# EAGLE design synapseWearV1-4 (EAGLE 9.1.3)
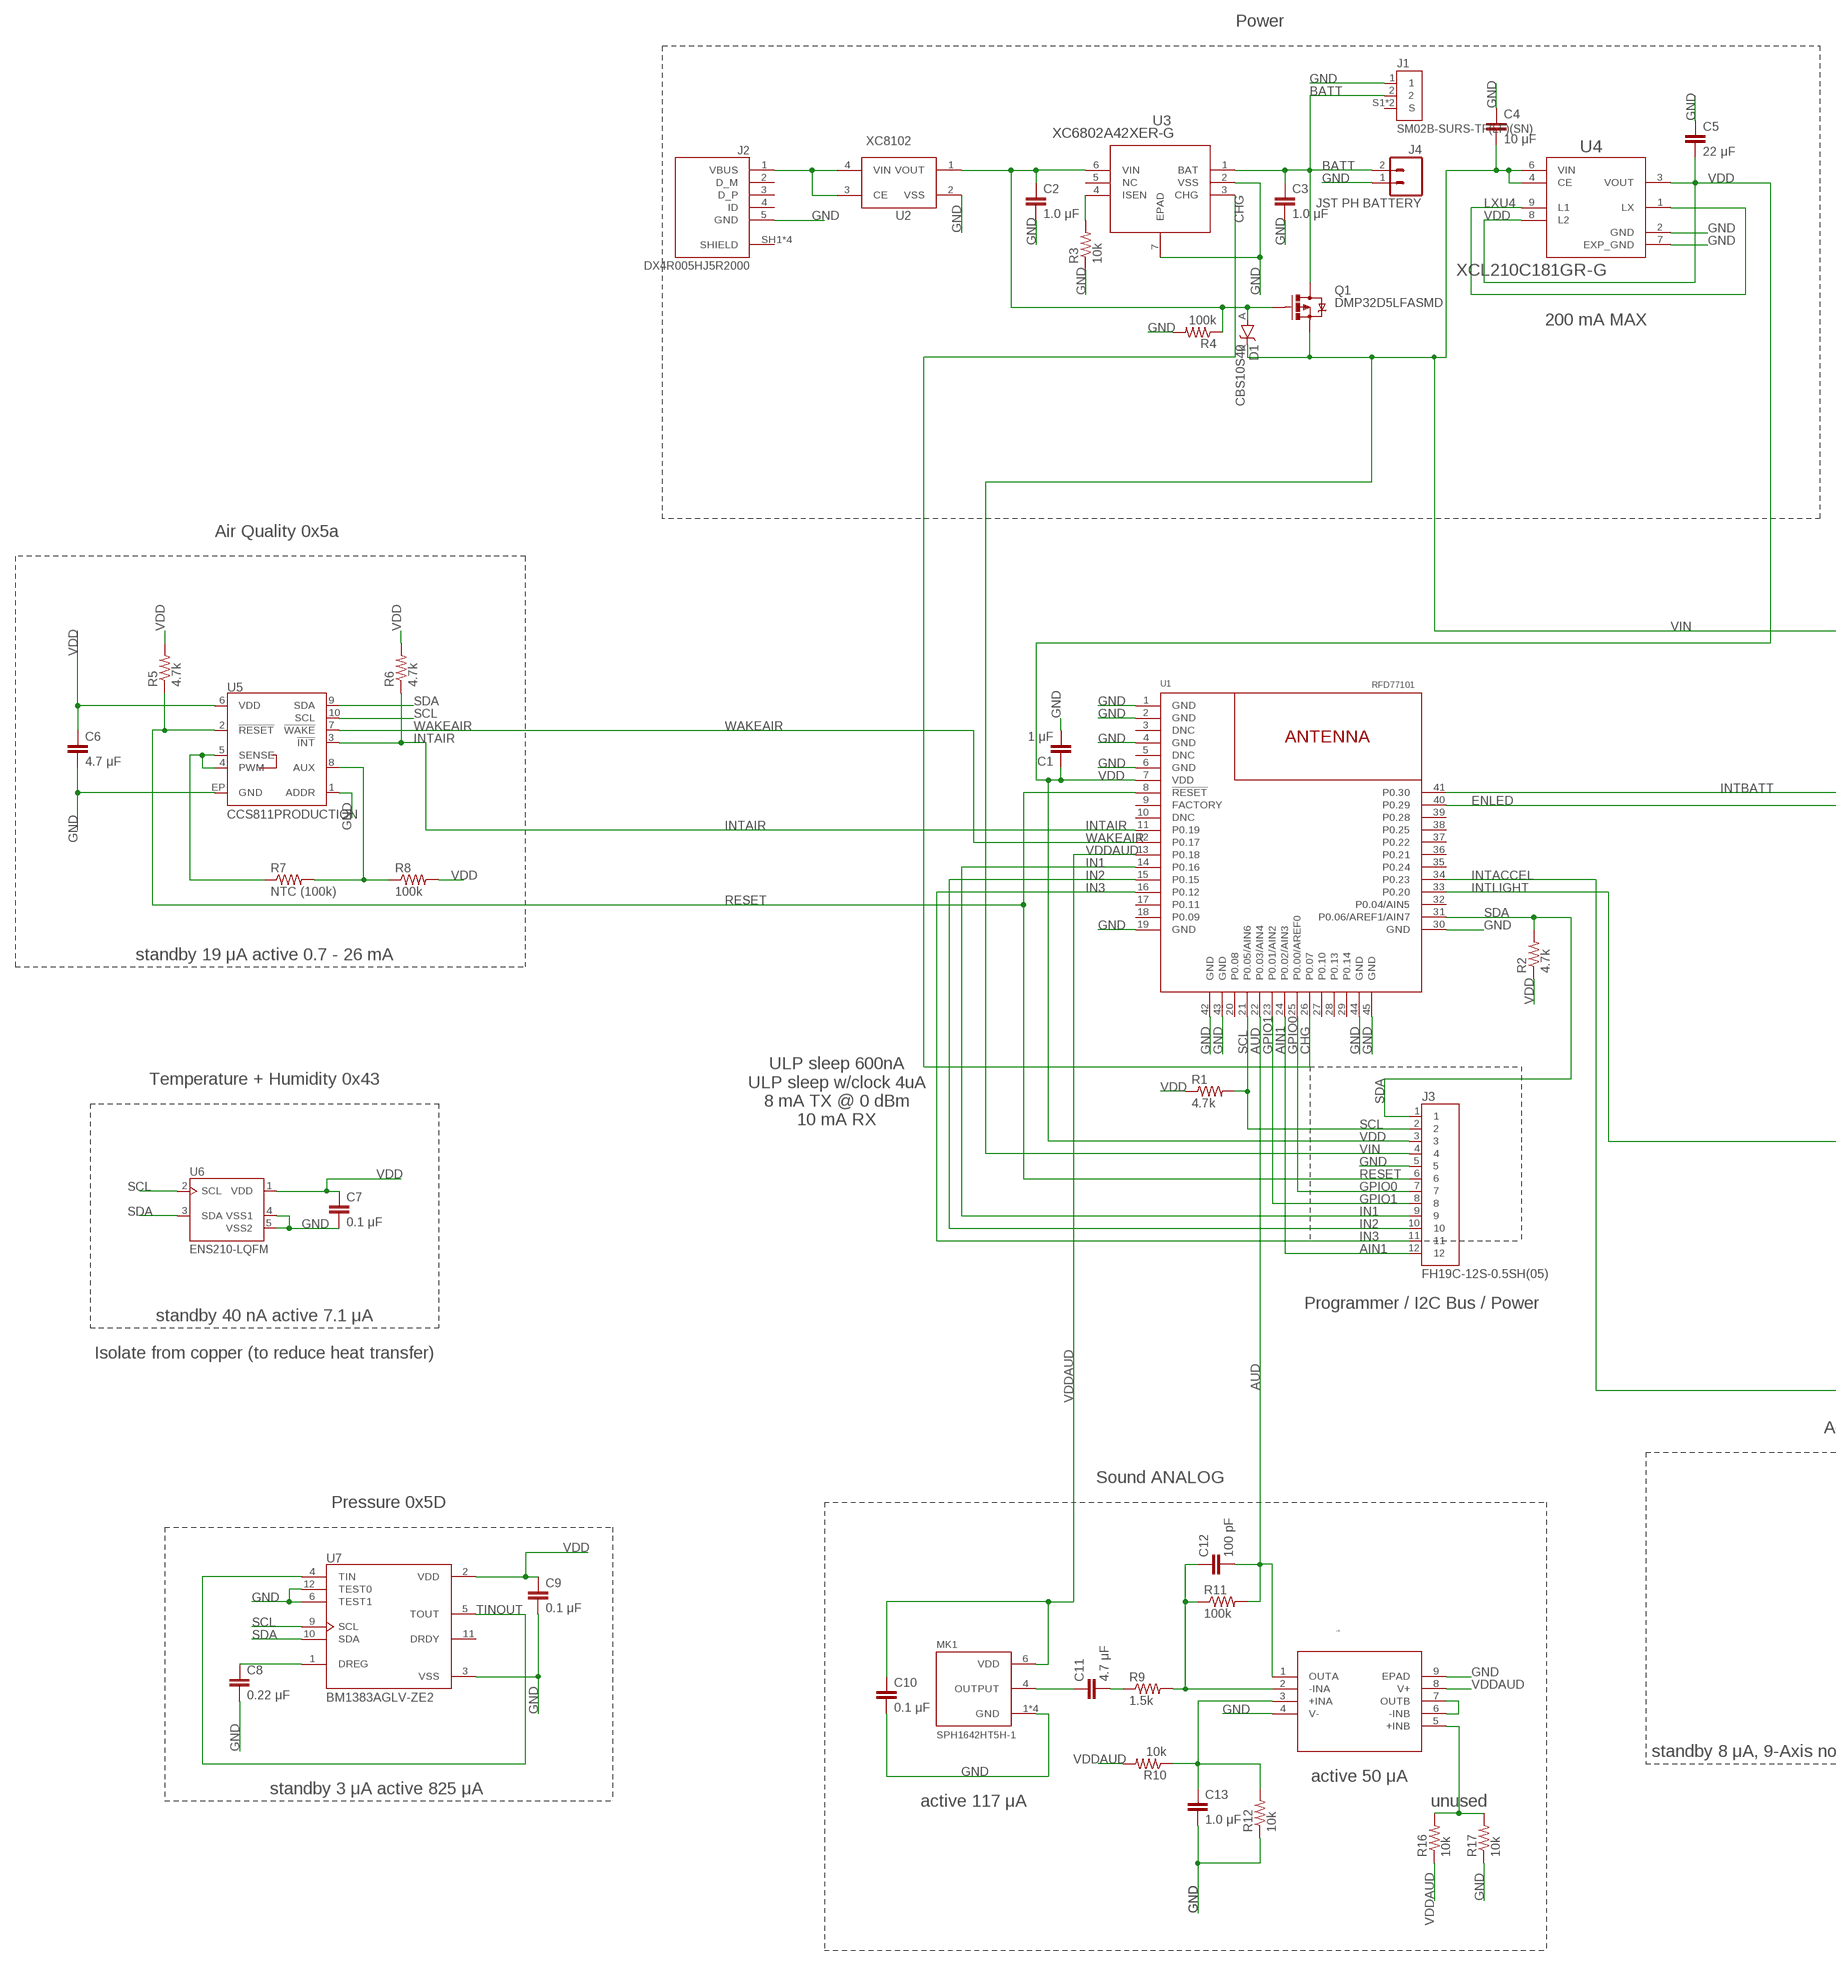
[diagram p0: schematic, sheet 1, part 1 of 2]
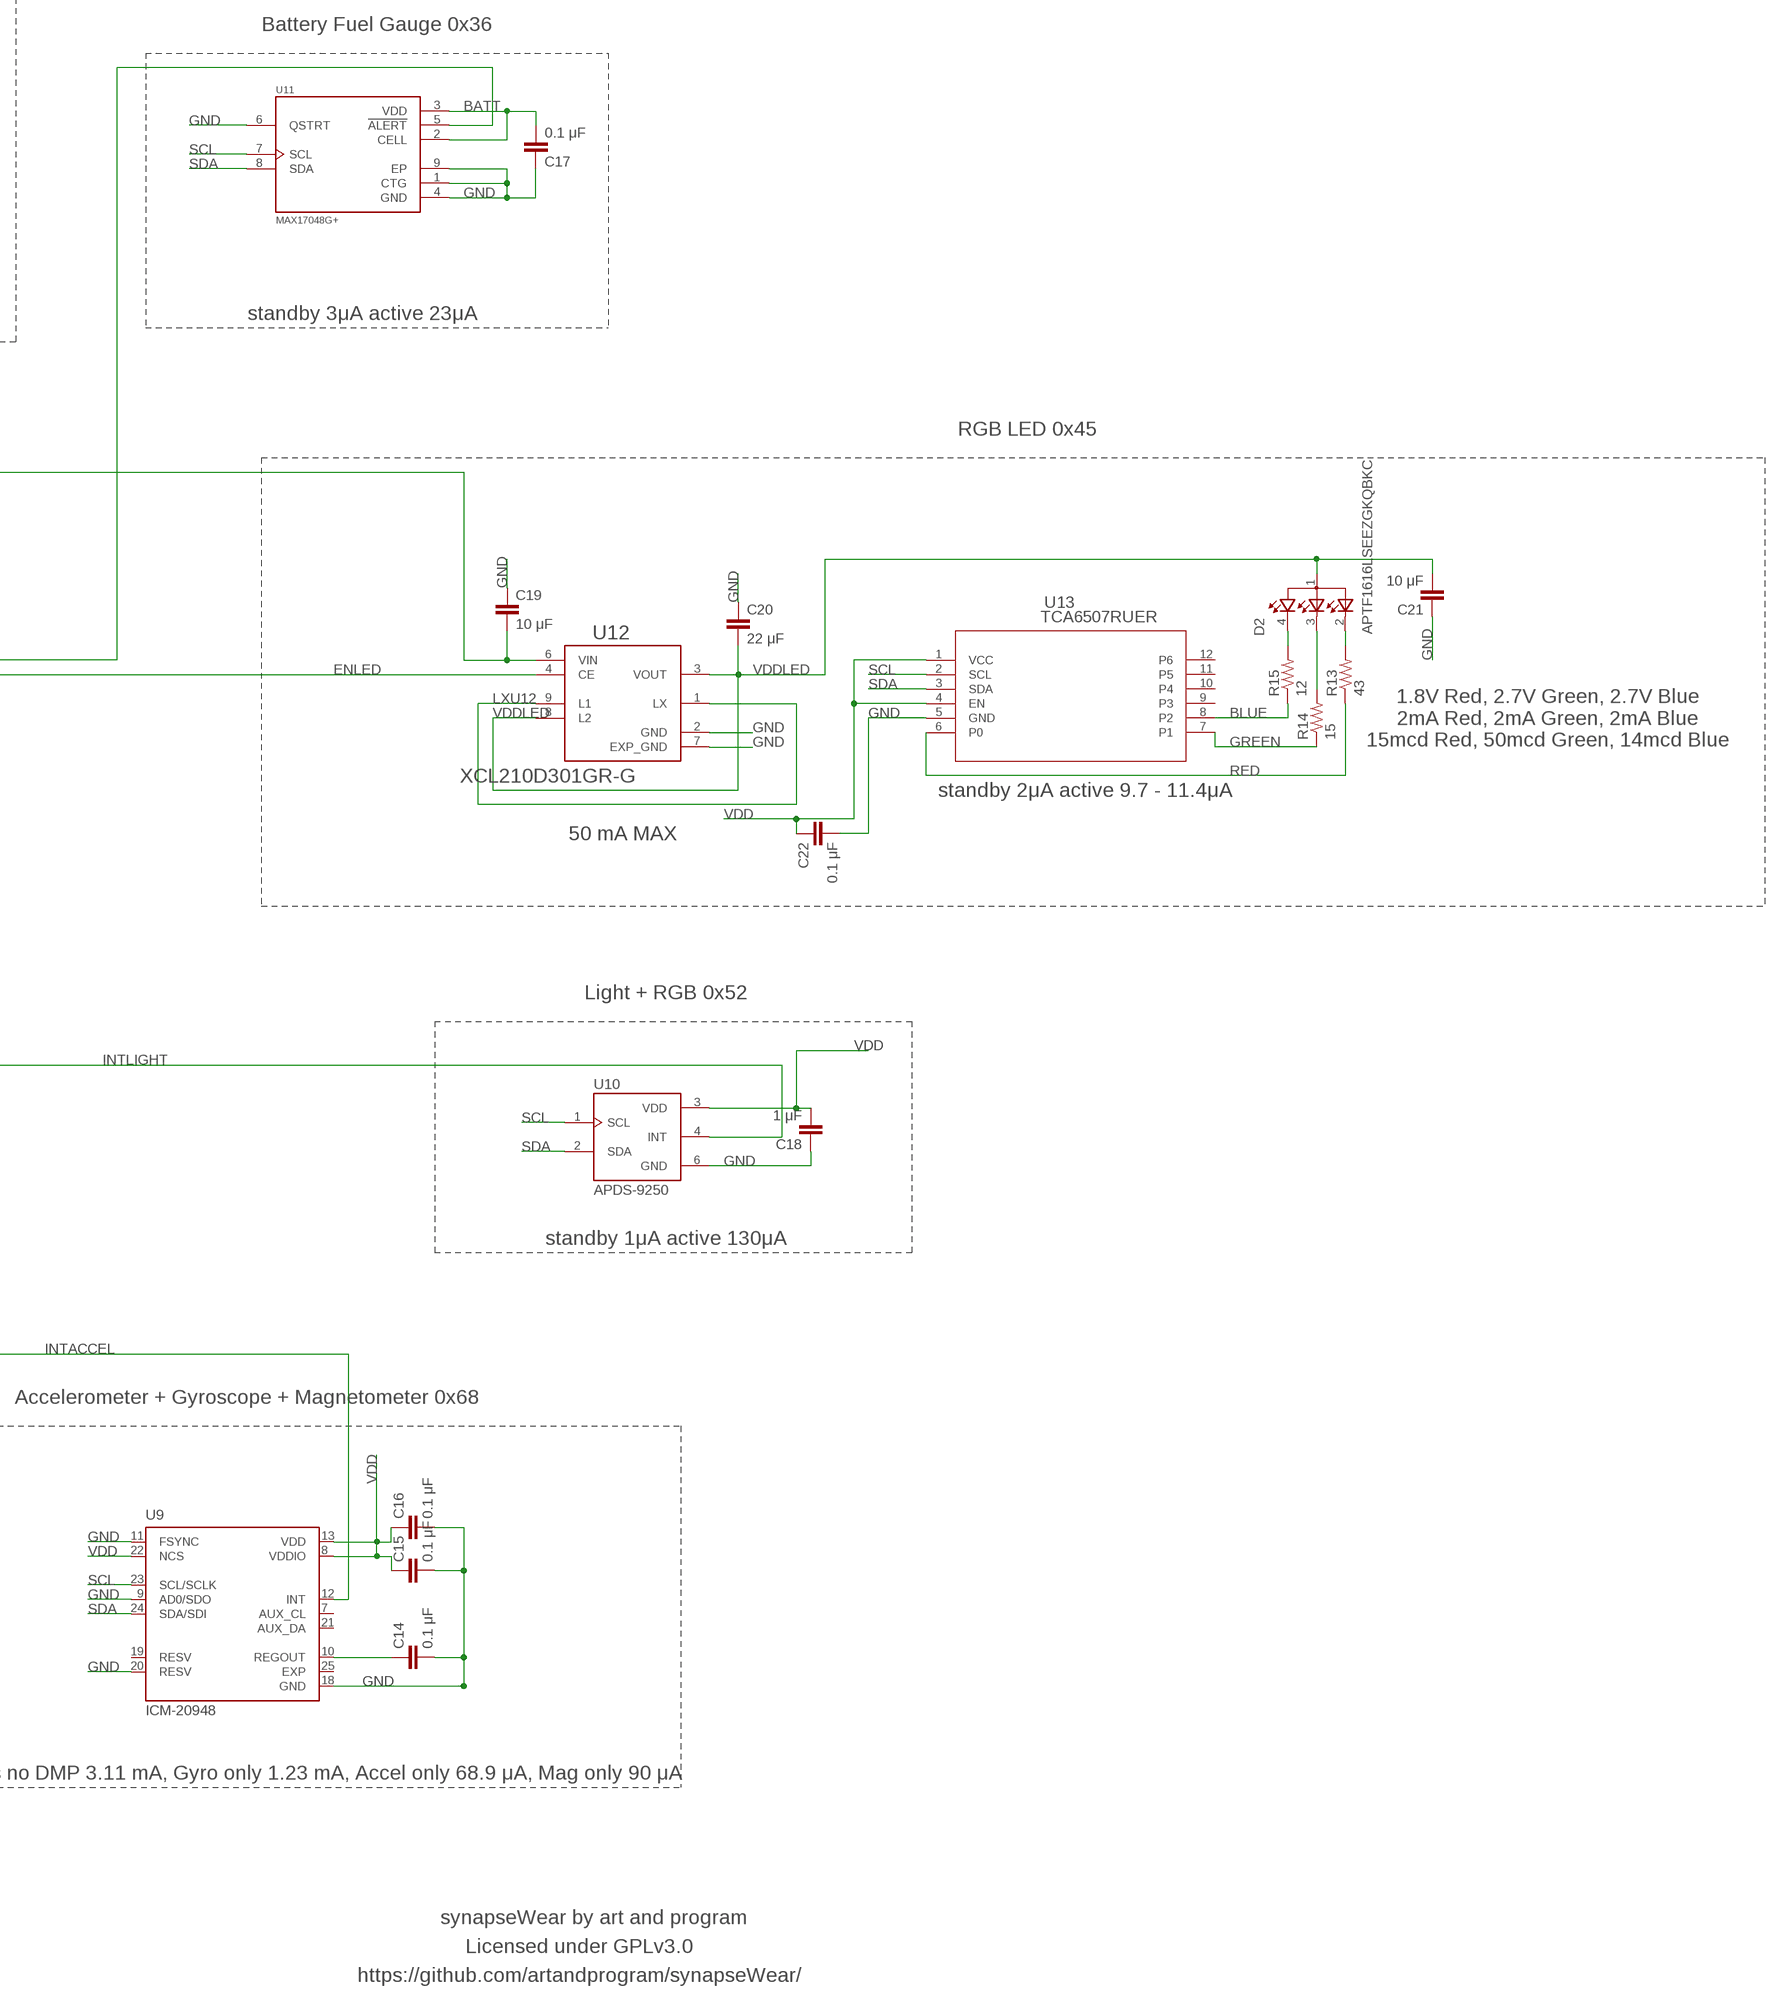
[diagram p1: schematic, sheet 1, part 2 of 2]

## Parts
C1  1 μF  CAP0402-CAP  [0402-CAP]
C2  1.0 μF  CAP0402-CAP  [0402-CAP]
C3  1.0 μF  CAP0402-CAP  [0402-CAP]
C4  10 μF  CAP0402-CAP  [0402-CAP]
C5  22 μF  CAP0402-CAP  [0402-CAP]
C6  4.7 μF  CAP0402-CAP  [0402-CAP]
C7  0.1 μF  CAP0402-CAP  [0402-CAP]
C8  0.22 μF  CAP0402-CAP  [0402-CAP]
C9  0.1 μF  CAP0402-CAP  [0402-CAP]
C10  0.1 μF  CAP0402-CAP  [0402-CAP]
C11  4.7 μF  CAP0402-CAP  [0402-CAP]
C12  100 pF  CAP0402-CAP  [0402-CAP]
C13  1.0 μF  CAP0402-CAP  [0402-CAP]
C14  0.1 μF  CAP0402-CAP  [0402-CAP]
C15  0.1 μF  CAP0402-CAP  [0402-CAP]
C16  0.1 μF  CAP0402-CAP  [0402-CAP]
C17  0.1 μF  CAP0402-CAP  [0402-CAP]
C18  1 μF  CAP0402-CAP  [0402-CAP]
C19  10 μF  CAP0402-CAP  [0402-CAP]
C20  22 μF  CAP0402-CAP  [0402-CAP]
C21  10 μF  CAP0402-CAP  [0402-CAP]
C22  0.1 μF  CAP0402-CAP  [0402-CAP]
D1  CBS10S40  [CST2B]
D2  APTF1616LSEEZGKQBKC  [LEDSC160X160X070-4N]
J1  SM02B-SURS-TF(LF)(SN)  [JST_SM02B-SURS-TF(LF)(SN)]
J2  DX4R005HJ5R2000  [JAE_DX4R005HJ5R2000]
J3  FH19C-12S-0.5SH(05)  [HRS_FH19C-12S-0.5SH(05)]
J4  JST PH BATTERY  M02JST-PTH-VERT  [JST-2-PTH-VERT]
MK1  SPH1642HT5H-1  [MIC_SPH1642HT5H-1]
Q1  DMP32D5LFASMD  [X2-DFN0806-3]
R1  4.7k  RESISTOR0402  [0402-RES]
R2  4.7k  RESISTOR0402  [0402-RES]
R3  10k  RESISTOR0402  [0402-RES]
R4  100k  RESISTOR0402  [0402-RES]
R5  4.7k  RESISTOR0402  [0402-RES]
R6  4.7k  RESISTOR0402  [0402-RES]
R7  NTC (100k)  RESISTOR0402  [0402-RES]
R8  100k  RESISTOR0402  [0402-RES]
R9  1.5k  RESISTOR0402  [0402-RES]
R10  10k  RESISTOR0402  [0402-RES]
R11  100k  RESISTOR0402  [0402-RES]
R12  10k  RESISTOR0402  [0402-RES]
R13  43  RESISTOR0402  [0402-RES]
R14  15  RESISTOR0402  [0402-RES]
R15  12  RESISTOR0402  [0402-RES]
R16  10k  RESISTOR0402  [0402-RES]
R17  10k  RESISTOR0402  [0402-RES]
U1  RFD77101  [RFD77101]
U2  XC8102  XC8102GR-G  [USP-4]
U3  XC6802A42XER-G  [USP-6C]
U4  XCL210C181GR-G  [CL-2025-02]
U5  CCS811PRODUCTION  [LGA10]
U6  ENS210-LQFM  [SON95P200X200X80-5N160X70]
U7  BM1383AGLV-ZE2  [PQFN55P250X250X100-12N]
U8  OPA2313IDRGT  [DRG8_1P2X2P0]
U9  ICM-20948  [QFN40P300X300X105-25N]
U10  APDS-9250  [SON65P200X200X75-6N]
U11  MAX17048G+  [SON50P200X200X80-9N]
U12  XCL210D301GR-G  [CL-2025-02]
U13  TCA6507RUER  [RUE12]

## Nets
+INA: C13.1 R10.1 R12.2 U8.3(+INA)
+INB: R16.2 R17.2 U8.5(+INB)
-INA: C12.1 R9.2 R11.1 U8.2(-INA)
-INB: U8.6(-INB) U8.7(OUTB)
AIN1: J3.12 U1.24(P0.02/AIN3)
AUD: C12.2 R11.2 U1.22(P0.03/AIN4) U8.1(OUTA)
AUX: R7.2 R8.1 U5.8(AUX)
BATT: C3.1 C17.2 J1.2 J4.2 Q1.D U3.1(BAT) U11.2(CELL) U11.3(VDD)
BLUE: R15.1 U13.8(P2)
CHG: U1.26(P0.07) U3.3(CHG)
DREG: C8.1 U7.1(DREG)
ENLED: U1.40(P0.29) U12.4(CE)
GND: C1.2 C2.2 C3.2 C4.1 C5.1 C6.2 C7.2 C8.2 C9.2 C10.2 C13.2 C14.2 C15.2 C16.2 C17.1 C18.1 C19.1 C20.1 C21.1 C22.2 J1.1 J2.5(GND) J3.5 J4.1 MK1.1(GND) MK1.2(GND) MK1.3(GND) MK1.5(GND) R3.1 R4.2 R12.1 R17.1 U1.1(GND) U1.2(GND) U1.4(GND) U1.6(GND) U1.19(GND) U1.30(GND) U1.42(GND) U1.43(GND) U1.44(GND) U1.45(GND) U2.2(VSS) U3.2(VSS) U3.7(EPAD) U4.2(GND) U4.7(EXP_GND) U5.1(ADDR) U5.EP(GND) U6.4(VSS1) U6.5(VSS2) U7.3(VSS) U7.6(TEST1) U7.12(TEST0) U8.4(V-) U8.9(EPAD) U9.9(AD0/SDO) U9.11(FSYNC) U9.18(GND) U9.20(RESV) U10.6(GND) U11.1(CTG) U11.4(GND) U11.6(QSTRT) U11.9(EP) U12.2(GND) U12.7(EXP_GND) U13.5(GND)
GPIO0: J3.7 U1.25(P0.00/AREF0)
GPIO1: J3.8 U1.23(P0.01/AIN2)
GREEN: R14.1 U13.7(P1)
IN1: J3.9 U1.14(P0.16)
IN2: J3.10 U1.15(P0.15)
IN3: J3.11 U1.16(P0.12)
INTACCEL: U1.34(P0.23) U9.12(INT)
INTAIR: R6.1 U1.11(P0.19) U5.3(!INT!)
INTBATT: U1.41(P0.30) U11.5(!ALERT)
INTLIGHT: U1.33(P0.20) U10.4(INT)
ISEN: R3.2 U3.4(ISEN)
LEDBRES: D2.4 R15.2
LEDGRES: D2.3 R14.2
LEDRRES: D2.2 R13.2
LXU4: U4.1(LX) U4.9(L1)
LXU12: U12.1(LX) U12.9(L1)
MKOUT1: C11.1 MK1.4(OUTPUT)
MKOUT2: C11.2 R9.1
NTC_SENSE: R7.1 U5.4(PWM) U5.5(SENSE)
RED: R13.1 U13.6(P0)
REGOUT: C14.1 U9.10(REGOUT)
RESET: J3.6 R5.1 U1.8(!RESET!) U5.2(!RESET!)
SCL: J3.2 R1.2 U1.21(P0.05/AIN6) U5.10(SCL) U6.2(SCL) U7.9(SCL) U9.23(SCL/SCLK) U10.1(SCL) U11.7(SCL) U13.2(SCL)
SDA: J3.1 R2.2 U1.31(P0.06/AREF1/AIN7) U5.9(SDA) U6.3(SDA) U7.10(SDA) U9.24(SDA/SDI) U10.2(SDA) U11.8(SDA) U13.3(SDA)
TINOUT: U7.4(TIN) U7.5(TOUT)
VBUS: C2.1 D1.A Q1.G R4.1 U2.1(VOUT) U3.6(VIN)
VCCUSB: J2.1(VBUS) U2.3(CE) U2.4(VIN)
VDD: C1.1 C5.2 C6.1 C7.1 C9.1 C15.1 C16.1 C18.2 C22.1 J3.3 R1.1 R2.1 R5.2 R6.2 R8.2 U1.7(VDD) U4.3(VOUT) U4.8(L2) U5.6(VDD) U6.1(VDD) U7.2(VDD) U9.8(VDDIO) U9.13(VDD) U9.22(NCS) U10.3(VDD) U13.1(VCC) U13.4(EN)
VDDAUD: C10.1 MK1.6(VDD) R10.2 R16.1 U1.13(P0.18) U8.8(V+)
VDDLED: C20.2 C21.2 D2.1 U12.3(VOUT) U12.8(L2)
VIN: C4.2 C19.2 D1.K J3.4 Q1.S U4.4(CE) U4.6(VIN) U12.6(VIN)
WAKEAIR: U1.12(P0.17) U5.7(!WAKE!)
Unconnected: J1.S1(S) J1.S2(S) J2.2(D_M) J2.3(D_P) J2.4(ID) J2.SH1(SHIELD) J2.SH2(SHIELD) J2.SH3(SHIELD) J2.SH4(SHIELD) U1.3(DNC) U1.5(DNC) U1.9(FACTORY) U1.10(DNC) U1.17(P0.11) U1.18(P0.09) U1.20(P0.08) U1.27(P0.10) U1.28(P0.13) U1.29(P0.14) U1.32(P0.04/AIN5) U1.35(P0.24) U1.36(P0.21) U1.37(P0.22) U1.38(P0.25) U1.39(P0.28) U3.5(NC) U7.11(DRDY) U9.7(AUX_CL) U9.19(RESV) U9.21(AUX_DA) U9.25(EXP) U13.9(P3) U13.10(P4) U13.11(P5) U13.12(P6)

## Notes on the sheet
- Power
- Battery Fuel Gauge 0x36
- 200 mA MAX
- standby 3μA active 23μA
- Air Quality 0x5a
- RGB LED 0x45
- 1.8V Red, 2.7V Green, 2.7V Blue
  2mA Red, 2mA Green, 2mA Blue
  15mcd Red, 50mcd Green, 14mcd Blue
- standby 2μA active 9.7 - 11.4μA
- 50 mA MAX
- standby 19 μA active 0.7 - 26 mA
- Temperature + Humidity 0x43 | Light + RGB 0x52
- ULP sleep 600nA
  ULP sleep w/clock 4uA
  8 mA TX @ 0 dBm
  10 mA RX
- standby 1μA active 130μA
- Programmer / I2C Bus / Power
- standby 40 nA active 7.1 μA
- Isolate from copper (to reduce heat transfer)
- Accelerometer + Gyroscope + Magnetometer 0x68
- Sound ANALOG
- Pressure 0x5D
- standby 8 μA, 9-Axis no DMP 3.11 mA, Gyro only 1.23 mA, Accel only 68.9 μA, Mag only 90 μA
- active 50 μA
- standby 3 μA active 825 μA
- active 117 μA | unused
- synapseWear by art and program
- Licensed under GPLv3.0
- https://github.com/artandprogram/synapseWear/

## Library data of the parts
C1-C22 = synapseWearV2:CAP: 0402 Capacitors
D1 = synapseWearV2:CBS10S40
D2 = synapseWearV2:APTF1616LSEEZGKQBKC: HELI Colour; 1.6X1.6MM LOW CURRENT RGB SMD LED; AVAILABILITY: Good; DESCRIPTION: HELI Colour; 1.6X1.6MM LOW CURRENT RGB SMD LED; MF: Kingbright; MP: APTF1616LSEEZGKQBKC; PACKAGE: 0606 Kingbright; PRICE: 0.47 USD
J1 = synapseWearV1-4:SM02B-SURS-TF(LF)(SN): CONN HEADER 2POS .8MM TIN SIDE E; AVAILABILITY: Good; DESCRIPTION: CONN HEADER 2POS .8MM TIN SIDE E; MF: JST Sales; MP: SM02B-SURS-TF(LF)(SN); PACKAGE: None; PRICE: 0.40 USD
J2 = synapseWearV1-3:DX4R005HJ5R2000: RCPT MICRO USB 2.0 B SMT H/D; AVAILABILITY: Good; DESCRIPTION: RCPT MICRO USB 2.0 B SMT H/D; MF: JAE Electronics; MP: DX4R005HJ5R2000; PACKAGE: None; PRICE: 115.69 USD
J3 = synapseWearV1-3:FH19C-12S-0.5SH(05): CONN FFC BOTTOM 12POS 0.50MM R/A; AVAILABILITY: Good; DESCRIPTION: FFC / FPC Board Connector, FH19C Series, Surface Mount, Receptacle, 12, Bottom, 0.5 mm; MF: Hirose Electric; MP: FH19C-12S-0.5SH(05); PACKAGE: None; PRICE: 1.13 USD
J4 = SparkFun-Connectors:M02: Standard 2-pin 0.1" header. Use with - straight break away headers ( PRT-00116) - right angle break away headers (PRT-00553) - swiss pins (PRT-00743) - machine pins (PRT-00117) - female headers (PRT-00115) Molex polarized connector foot print use with: PRT-08233 with associated crimp pins and housings. 2.54_SCREWTERM for use with PRT-10571. 3.5mm Screw Terminal footprints for PRT-08084 5mm Screw Terminal footprints for use with PRT-08432
MK1 = synapseWearV2:SPH1642HT5H-1: Mic Mems Analog Omni -38db; AVAILABILITY: Good; DESCRIPTION: Mic Mems Analog Omni -38db; MF: Knowles Acoustics; MP: SPH1642HT5H-1; PACKAGE: None; PRICE: 1.13 USD
Q1 = synapseWearV2:DMP32D5LFA: DMP32D5LFA
R1-R17 = synapseWearV2:RESISTOR: 0402 Resistors
U1 = synapseWearV2:RFD77101: Simblee ™ BLE Module RFD77101 © 2015 RF Digital Corporation www.RFDigital.com www.Simblee.com PATENTS PENDING 04.01.2015
U2 = synapseWearV2:XC8102GR-G
U3 = synapseWearV2:XC6802A42XER-G; MANUFACTURER_PART_NUMBER: XC6802A42XER-G; VENDOR: Torex Semiconductor
U4 = synapseWearV2:XCL210C181GR-G: Conv DC-DC Single Step Down 1.8V 2V to 6V 8-Pin CL-2025 T/R; DESCRIPTION: Conv DC-DC Single Step Down 1.8V 2V to 6V 8-Pin CL-2025 T/R; DIGI-KEY_PART_NUMBER: 893-1251-1-ND; DIGI-KEY_PURCHASE_URL: https://www.digikey.jp/product-detail/en/torex-semiconductor-ltd/XCL210C181GR-G/893-1251-1-ND/5964793?WT.z_cid=ref_snapeda&utm_source=snapeda&utm_medium=aggregator&utm_campaign=buynow; MF: Torex; MP: XCL210C181GR-G; PACKAGE: SMD-8 Torex
U5 = synapseWearV2:CCS811: AMS CCS811 – I2C Digital Gas Sensor Ultra-Low Power Digital Gas Sensor for Monitoring Indoor Air Quality AMS Product Page <http://ams.com/eng/Products/Environmental-Sensors/Gas-Sensors/CCS811> SparkFun Products:
U6 = synapseWearV2:ENS210-LQFM: ENS210 Series 3.6V 100%RH Relative Humidity & Temperature Sensor w/I²C Interface; DESCRIPTION: ENS210 Series 3.6V 100%RH Relative Humidity & Temperature Sensor w/I²C Interface; DIGI-KEY_PART_NUMBER: ENS210-LQFMCT-ND; DIGI-KEY_PURCHASE_URL: https://www.digikey.jp/product-detail/en/ams/ENS210-LQFM/ENS210-LQFMCT-ND/6490749?WT.z_cid=ref_snapeda&utm_source=snapeda&utm_medium=aggregator&utm_campaign=buynow; MF: ams; MP: ENS210-LQFM; PACKAGE: QFN-4 ams
U7 = synapseWearV2:BM1383AGLV-ZE2: Pressure Sensor 30kPa to 110kPa 12-Pin CLGA T/R; AVAILABILITY: Good; DESCRIPTION: Pressure Sensor 30kPa to 110kPa 12-Pin CLGA T/R; MF: Rohm; MP: BM1383AGLV-ZE2; PACKAGE: VFLGA-12 Rohm; PRICE: 5.29 USD
U8 = synapseWearV2:OPA2313IDRGT; MANUFACTURER_PART_NUMBER: OPA2313IDRGT; VENDOR: Texas Instruments
U9 = synapseWearV2:ICM-20948: GYRO/ACCEL/COMPASS/9-AXIS; AVAILABILITY: Good; DESCRIPTION: SMD Gyroscope/Accelerometer/Magnetometer Sensor; 9-AXIS; MF: InvenSense; MP: ICM-20948; PACKAGE: QFN-24 InvenSense
U10 = synapseWearV2:APDS-9250: Digital RGB, IR and Ambient Light Sensor with I2C Output; AVAILABILITY: Good; DESCRIPTION: Digital RGB, IR and Ambient Light Sensor with I2C Output; MF: Avago; MP: APDS-9250; PACKAGE: - Avago; PRICE: 1.17 USD
U11 = synapseWearV2:MAX17048G+: Micropower 1-Cell/2-Cell Li+ ModelGauge ICs; AVAILABILITY: Bad; DESCRIPTION: Fuel Gauge Li-Ion 8-Pin Tdfn Ep; MF: Maxim Integrated; MP: MAX17048G+; PACKAGE: TDFN-8 Maxim Integrated; PRICE: None
U12 = synapseWearV2:XCL210D301GR-G: Conv DC-DC Single Step Down 3V 2V to 6V 8-Pin CL-2025 T/R; DESCRIPTION: Conv DC-DC Single Step Down 3V 2V to 6V 8-Pin CL-2025 T/R; MF: Torex; MOUSER_PURCHASE_URL: https://www.mouser.jp/ProductDetail/Torex-Semiconductor/XCL210D301GR-G/?qs=%2fha2pyFaduh48KYoemvo%2fAcDXCeWNnSbMJ2P5IMkT%252bdplPvtkBni7w%3d%3d; MP: XCL210D301GR-G; PACKAGE: SMD-8 Torex
U13 = synapseWearV2:TCA6507RUER; MANUFACTURER_PART_NUMBER: TCA6507RUER; VENDOR: Texas Instruments

## Board
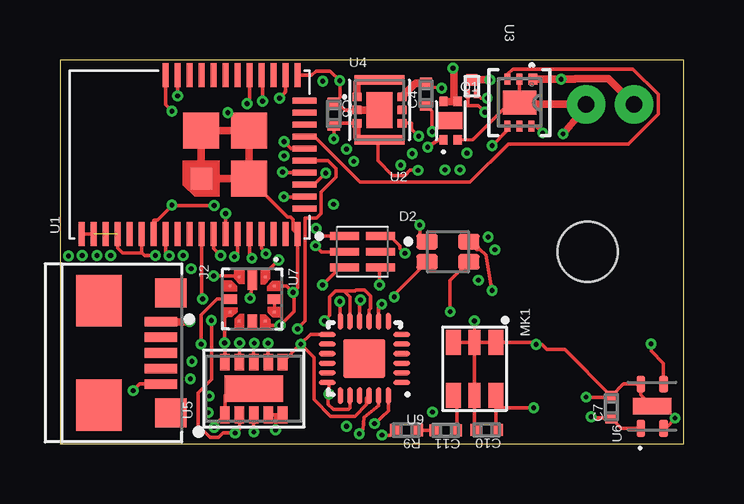
[diagram p2: board, top side]
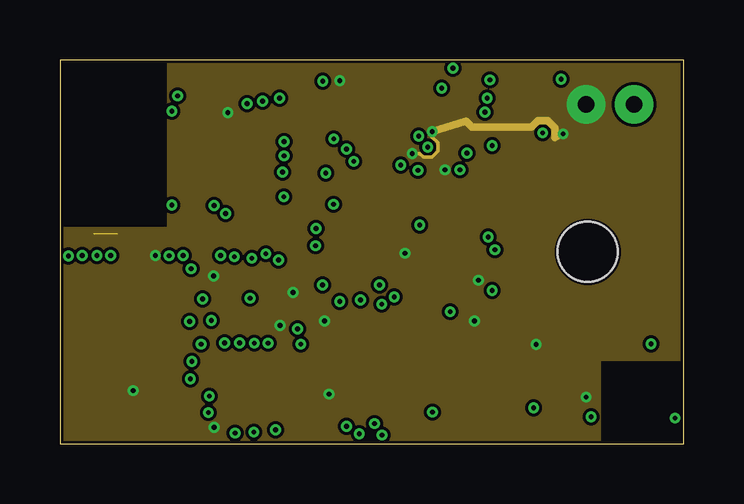
[diagram p3: board, inner layer Route2]
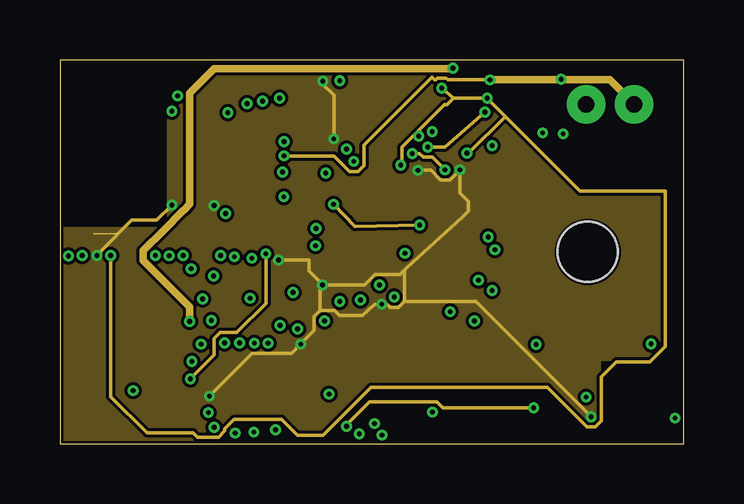
[diagram p4: board, inner layer Route3]
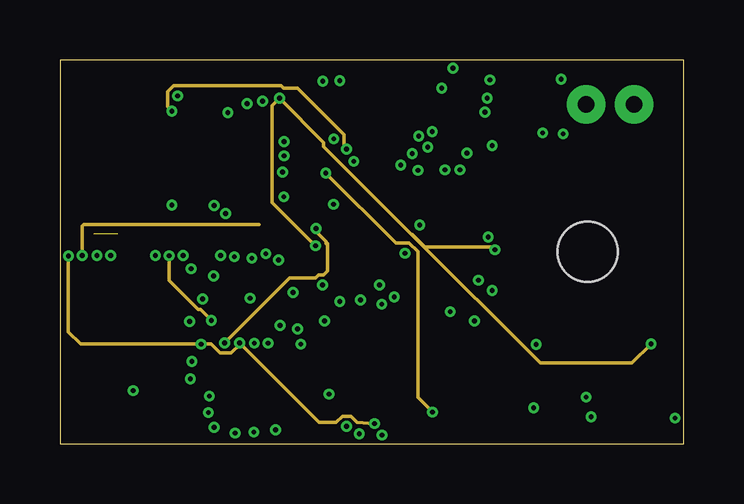
[diagram p5: board, inner layer Route4]
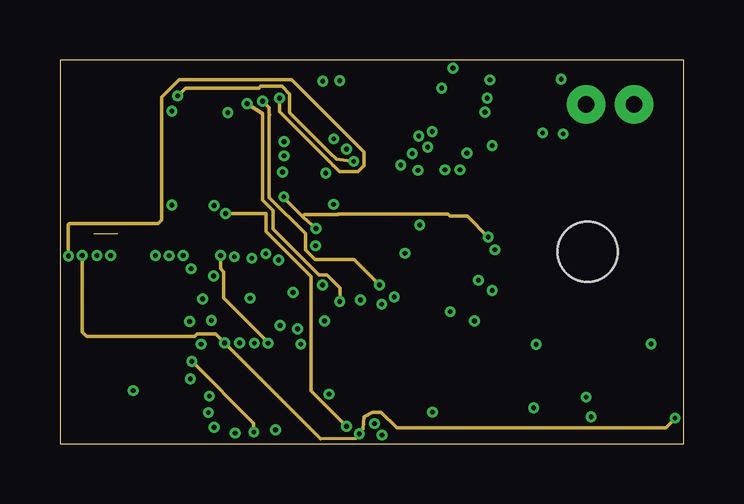
[diagram p6: board, inner layer Route5]
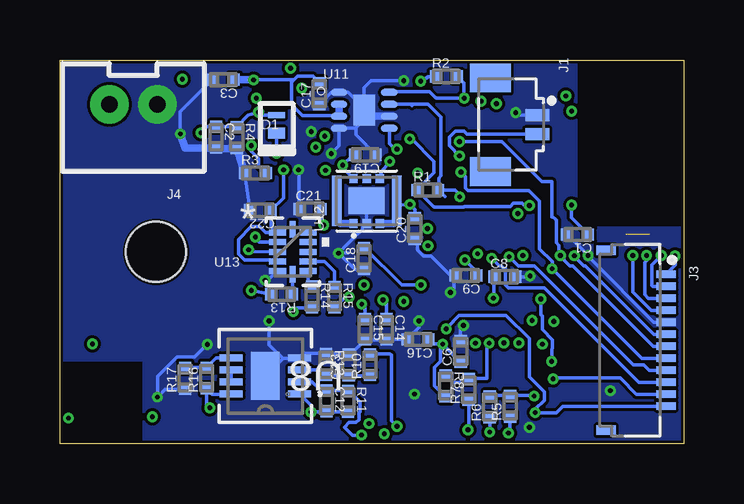
[diagram p7: board, bottom side, seen from below]

Size 26 x 16 mm. Coordinates in mm from the lower left corner, seen from the top.
Outline: 0,0 26,0 26,16 0,16 0,0
Copper layers (1+2+3+4+5+16): Top 0.035mm / dielectric 0.2mm / Route2 0.035mm / dielectric 0.2mm / Route3 0.035mm / dielectric 0.2mm / Route4 0.035mm / dielectric 0.15mm / Route5 0.035mm / dielectric 0.2mm / Bottom 0.035mm
Design rules "synapseWearV2 *": minimum track width 0.125mm, minimum drill 0.2mm, track to track 0.125mm, track to pad 0.125mm, pad to pad 0.125mm, via to via 0.125mm, smd to smd 0.125mm, copper to edge 0.125mm, drill to drill 0.125mm, minimum pad ring 0.125mm, minimum via ring 0.125mm, stop-mask expansion 1mil, vias tented up to drill 1mil, thermal gap 10mil
Holes 2.5 mm at 22,8
tRestrict: area 18,4 to 26,12

### Footprints (pad centres in the part's own frame; a part is rotated, then mirrored left to right if it is on the bottom)
0402-CAP = smd 0.457 x 0.508: 1 -0.457,0; 2 0.457,0
CST2B = smd 0.7 x 0.25: A 0,-0.425 | smd 0.7 x 0.45: K 0,0.325
LEDSC160X160X070-4N = smd 0.89 x 0.64: 1 -0.87,0.425; 2 0.87,0.425; 3 0.87,-0.425; 4 -0.87,-0.425
JST_SM02B-SURS-TF(LF)(SN) = smd 0.5 x 1: 1 -0.4,0; 2 0.4,0 | smd 1.2 x 1.7: S1 -1.95,-1.95; S2 1.95,-1.95
JAE_DX4R005HJ5R2000 = smd 0.4 x 1.35: 1 -1.3,0; 2 -0.65,0; 3 0,0; 4 0.65,0; 5 1.3,0 | smd 1.2 x 1.3: SH1 -2.5,0.425; SH2 2.5,0.425 | smd 2.15 x 1.9: SH3 -2.175,-2.575; SH4 2.175,-2.575
HRS_FH19C-12S-0.5SH(05) = smd 0.3 x 0.8: 1 -2.75,0; 2 -2.25,0; 3 -1.75,0; 4 -1.25,0; 5 -0.75,0; 6 -0.25,0; 7 0.25,0; 8 0.75,0; 9 1.25,0; 10 1.75,0; 11 2.25,0; 12 2.75,0 | smd 0.4 x 0.8: 13 -3.75,-2.5; 14 3.75,-2.5
JST-2-PTH-VERT = drill 0.7 pad 1.6: 1 -1,-0.55; 2 1,-0.55
MIC_SPH1642HT5H-1 = smd 1.032 x 0.622: 1 -1.104,0.884; 3 -1.104,-0.884; 4 1.104,-0.884; 6 1.104,0.884 | smd 1.032 x 0.5: 2 -1.104,0; 5 1.104,0
X2-DFN0806-3 = smd 0.45 x 0.475: D 0,0.263 | smd 0.2 x 0.375: G -0.175,-0.312; S 0.175,-0.312
0402-RES = smd 0.457 x 0.508: 1 -0.457,0; 2 0.457,0
RFD77101 = smd 1 x 0.254: 1 0,0; 2 0,-0.5; 3 0,-1; 4 0,-1.5; 5 0,-2; 6 0,-2.5; 7 0,-3; 8 0,-3.5; 9 0,-4; 10 0,-4.5; 11 0,-5; 12 0,-5.5; 13 0,-6; 14 0,-6.5; 15 0,-7; 16 0,-7.5; 17 0,-8; 18 0,-8.5; 19 0,-9; 30 6.61,-9; 31 6.61,-8.5; 32 6.61,-8; 33 6.61,-7.5; 34 6.61,-7; 35 6.61,-6.5; 36 6.61,-6; 37 6.61,-5.5; 38 6.61,-5; 39 6.61,-4.5; 40 6.61,-4; 41 6.61,-3.5 | smd 0.254 x 1: 20 1.055,-9.29; 21 1.555,-9.29; 22 2.055,-9.29; 23 2.555,-9.29; 24 3.055,-9.29; 25 3.555,-9.29; 26 4.055,-9.29; 27 4.555,-9.29; 28 5.055,-9.29; 29 5.555,-9.29 | smd 0.9 x 0.9: 42 2.3,-4.99 | smd 1.5 x 1.5: 43 2.3,-6.99; 44 4.3,-6.99; 45 4.3,-4.99
USP-4 = smd 1 x 0.7: 0 0,0 | smd 0.35 x 0.4: 1 -0.3,-0.8; 2 0.3,-0.8; 3 0.3,0.8; 4 -0.3,0.8
USP-6C = smd 0.457 x 0.356: 1 -0.975,0.553 | smd 0.45 x 0.25: 2 -0.975,0; 3 -0.975,-0.5; 4 0.975,-0.5; 5 0.975,0; 6 0.975,0.5 | smd 1 x 1.4: 7 0,0
CL-2025-02 = smd 0.375 x 0.35: 1 -0.938,0.55; 2 -0.938,0; 3 -0.938,-0.55; 4 0.938,-0.55; 5 0.938,0; 6 0.938,0.55 | smd 1.1 x 1.5: 7 0,0 | smd 2.1 x 0.4: 8 0,-1.25; 9 0,1.25
LGA10 = smd 0.7 x 0.4: 1 -1.1,1.2; 2 -1.1,0.6; 3 -1.1,0; 4 -1.1,-0.6; 5 -1.1,-1.2; 6 1.1,-1.2; 7 1.1,-0.6; 8 1.1,0; 9 1.1,0.6; 10 1.1,1.2 | smd 1.1 x 2.45: EP 0,0
SON95P200X200X80-5N160X70 = smd 0.73 x 0.37: 1 -0.92,0.475; 2 -0.92,-0.475; 3 0.92,-0.475; 4 0.92,0.475 | smd 0.7 x 1.6: 5 0,0
PQFN55P250X250X100-12N = smd 0.83 x 0.4: 1 -0.8,0 | smd 0.1 x 0.1: 2 -0.925,0.55; 3 -0.55,0.925; 5 0.55,0.925; 6 0.925,0.55; 8 0.925,-0.55; 9 0.55,-0.925; 11 -0.55,-0.925; 12 -0.925,-0.55 | smd 0.4 x 0.58: 4 0,0.925; 10 0,-0.925 | smd 0.58 x 0.4: 7 0.925,0
DRG8_1P2X2P0 = smd 0.95 x 0.28: 1 -1.425,0.75; 2 -1.425,0.25; 3 -1.425,-0.25; 4 -1.425,-0.75; 5 1.425,-0.75; 6 1.425,-0.25; 7 1.425,0.25; 8 1.425,0.75 | smd 1.2 x 2: 9 0,0
QFN40P300X300X105-25N = smd 0.7 x 0.2: 1 -1.55,1; 2 -1.55,0.6; 3 -1.55,0.2; 4 -1.55,-0.2; 5 -1.55,-0.6; 6 -1.55,-1; 13 1.55,-1; 14 1.55,-0.6; 15 1.55,-0.2; 16 1.55,0.2; 17 1.55,0.6; 18 1.55,1 | smd 0.2 x 0.7: 7 -1,-1.55; 8 -0.6,-1.55; 9 -0.2,-1.55; 10 0.2,-1.55; 11 0.6,-1.55; 12 1,-1.55; 19 1,1.55; 20 0.6,1.55; 21 0.2,1.55; 22 -0.2,1.55; 23 -0.6,1.55; 24 -1,1.55 | smd 1.75 x 1.6: 25 0,0
SON65P200X200X75-6N = smd 1.24 x 0.32: 1 -0.745,0.65; 2 -0.745,0; 3 -0.745,-0.65; 4 0.745,-0.65; 5 0.745,0; 6 0.745,0.65
SON50P200X200X80-9N = smd 0.7 x 0.3: 1 -1.05,0.75; 2 -1.05,0.25; 3 -1.05,-0.25; 4 -1.05,-0.75; 5 1.05,-0.75; 6 1.05,-0.25; 7 1.05,0.25; 8 1.05,0.75 | smd 0.9 x 1.3: 9 0,0
RUE12 = smd 0.704 x 0.25: 1 -0.636,0.8; 2 -0.636,0.4; 3 -0.636,0; 4 -0.636,-0.4; 5 -0.636,-0.8; 7 0.636,-0.8; 8 0.636,-0.4; 9 0.636,0; 10 0.636,0.4; 11 0.636,0.8 | smd 0.25 x 0.704: 6 0,-0.936; 12 0,0.936

### Placement (x,y rotation side)
C1  4.42,8.71 180 bottom
C2  19.48,12.78 270 bottom
C3  19.2,15.18 180 bottom
C4  15.26,14.58 90 top
C5  11.41,13.74 270 top
C6  9.29,3.85 90 bottom
C7  22.99,1.52 90 top
C8  7.46,6.96 0 bottom
C9  9.08,7.01 180 bottom
C10  17.79,0.57 180 top
C11  16.09,0.56 180 top
C12  14.89,1.77 270 bottom
C13  13.96,3.27 90 bottom
C14  12.38,4.77 270 bottom
C15  13.29,4.77 270 bottom
C16  11.07,4.34 180 bottom
C17  15.19,14.6 90 bottom
C18  13.32,7.72 90 bottom
C19  13.27,12.04 180 bottom
C20  11.21,8.97 90 bottom
C21  15.57,9.78 0 bottom
C22  17.64,9.73 180 bottom
D1  16.96,13.28 180 bottom
D2  16.18,8 0 top
J1  6.1,13.3 270 bottom
J2  4.2,3.78 270 top
J3  0.73,4.31 270 bottom
J4  22.94,13.6 180 bottom
MK1  17.29,3.12 270 top
Q1  17.18,14.91 0 top
R1  10.66,10.57 0 bottom
R2  9.89,15.31 0 bottom
R3  17.84,11.28 0 bottom
R4  18.62,12.77 270 bottom
R5  7.23,1.55 90 bottom
R6  8.08,1.53 90 bottom
R7  8.96,2.25 90 bottom
R8  9.92,2.4 270 bottom
R9  14.44,0.56 180 top
R10  13.07,3.29 90 bottom
R11  13.98,1.76 270 bottom
R12  14.91,3.29 270 bottom
R13  16.75,6.23 180 bottom
R14  15.48,6.12 270 bottom
R15  14.55,6.11 270 bottom
R16  19.88,2.73 90 bottom
R17  20.78,2.73 90 bottom
U1  0.9,8.75 90 top
U2  16.29,13.46 0 top
U3  19.16,14.22 270 top
U4  13.32,13.91 0 top
U5  8.08,2.29 90 top
U6  24.69,1.56 90 top
U7  8.02,6.03 270 top
U8  17.43,2.82 180 bottom
U9  12.69,3.55 180 top
U10  12.61,8 0 top
U11  13.32,13.9 0 bottom
U12  13.21,10.12 90 bottom
U13  16.3,8 0 bottom

### Tracks (layer width: path | path; a pad name or v marks a point on that pad's centre or on a via)
+INA
  Bottom 0.152: U8.3 15.14,3.07 R12.2 13.97,2.84 C13.1 13.09,2.82 R10.1
+INB
  Bottom 0.152: U8.5 19.5,3.57 R16.2 R17.2
-INA  (via drill 0.2)
  Top 0.152: R9.2 13.77,0.35 v13.43,0.35
  Bottom 0.152: U8.2 15.48,2.57 15.14,2.23 C12.1 R11.1 13.49,1.73 13.49,1.33 13.53,1.29 13.53,1 13.65,0.88 13.94,0.88 14.14,0.68 13.81,0.35 v13.43,0.35
-INB
  Bottom 0.152: U8.6 U8.7
AIN1  (via drill 0.2)
  Top 0.152: v9.9,4.78 10.23,5.11 10.23,9.41 10.71,9.41 10.89,9.6 10.89,10.49 11.51,11.11 11.51,11.46 11.17,11.8 U1.24
  Bottom 0.152: J3.12 5.03,1.56 5.3,1.29 v6.19,1.29 6.19,1.42 5.8,1.8 5.8,2.16 6.43,2.79 6.43,4.38 7.41,5.35 9.36,5.35 9.61,5.1 9.61,5.07 v9.9,4.78
AUD  (via drill 0.2)
  Top 0.152: v11.08,11.29 | v11.08,11.29 10.6,10.8 U1.22
  Route4 0.152: v11.08,11.29 14,8.37 14.56,8.37 14.92,8 14.92,1.93 v15.53,1.32
  Bottom 0.152: 15.64,2.07 U8.1 15.53,1.59 v15.53,1.32 C12.2 13.99,1.32 R11.2
AUX  (via drill 0.2)
  Top 0.152: v8.1,4.19 8.08,4.17 U5.8
  Bottom 0.152: v8.1,4.19 8.19,4.1 8.19,2.71 R7.2 9.12,2.55 9.61,2.55 R8.1
BATT  (via drill 0.2)
  Top 0.152: 17.11,15.17 Q1.D
  Top 0.305: v17.93,15.17 17.11,15.17 | U3.1 v20.89,15.2 21.46,15.2 21.49,15.23 22.86,15.23 J4.2
  Route3 0.152: v9.34,12 11.42,12 12.07,11.34 12.43,11.34 12.68,11.59 12.68,12.46 15.5,15.28 15.61,15.17 15.67,15.17 15.74,15.25 16.1,15.25 16.17,15.17 v17.93,15.17
  Route3 0.305: J4.2 22.92,15.17 18.7,15.17 v17.93,15.17
  Bottom 0.152: C3.1 | U11.3 14.39,13.68 15.89,13.68 16.35,14.14 16.35,15.07 16.24,15.17 | 16.24,15.17 16.1,15.32 15.45,15.32 C17.2 | 16.24,15.17 v17.93,15.17 | v9.34,12 9.77,12.42 9.77,12.78 9.52,13.03 9.16,13.03 9.04,12.9 J1.2
  Bottom 0.305: U11.2 U11.3 | v17.93,15.17 C3.1 | 23.7,13.91 J4.2
BLUE
  Bottom 0.152: R15.1 14.55,7.18 14.97,7.6 U13.8
CHG
  Top 0.152: U3.3 18.66,15.41 18.88,15.62 23.88,15.62 24.94,14.56 24.94,14.4 24.94,14 24.94,13.73 23.7,12.49 18.69,12.49 17.1,10.91 12.51,10.91 10.61,12.8 U1.26
DREG  (via drill 0.2)
  Top 0.152: v7.93,6.06 8.05,6.79 U7.1
  Bottom 0.152: C8.1 7.91,6.23 v7.93,6.06
ENLED  (via drill 0.2)
  Top 0.152: v4.91,14.5 U1.40
  Route5 0.152: v12.25,11.77 11.53,11.86 11.24,12.14 9.58,13.81 9.58,14.58 9.26,14.9 8.37,14.9 8.3,14.83 5.23,14.83 v4.91,14.5
  Bottom 0.152: U12.4 12.62,11.33 v12.25,11.77
GND  (via drill 0.2)  (1 unrouted)
  Top 0.152: U1.1 U1.2 | U4.2 11.89,13.91 arc-45 11.86,13.92 11.62,14.16 arc45 11.52,14.2 C5.1 11.67,14.46 v11.67,15.13 11.26,15.54 10.67,15.54 10.49,15.36 U1.30 | U3.2 U3.7 18.76,14.22 17.21,12.68 U2.2 | C7.2 23.49,2.48 U6.4 24.21,2.04 U6.5 | v14.38,7.94 14.18,8.14 14.18,8.23 13.76,8.65 U10.6 | C7.2 21.04,3.92 20.31,3.92 20.1,4.13 v19.86,4.13 19.77,4.22 MK1.1 MK1.2 | C10.2 17.29,0.62 MK1.5 MK1.2 | MK1.3 MK1.2 | MK1.2 v17.29,5.12 v17.28,5.12 | U5.EP 7.16,2.29 6.88,2.02 U5.1 6.43,0.74 v6.43,0.68 | U9.20 12.09,1.48 12.03,1.42 11.4,1.42 11.18,1.64 11.18,2.02 v11.22,2.06 11.22,2.47 U9.18 11.18,2.51 | U7.3 9.45,6.58 v9.72,6.3 9.77,6.35 | U7.6 8.74,4.93 v9.18,4.93 9.77,5.52 9.77,6.35 | v6.4,6.99 7.43,6.99 U7.12 | 11.85,6.36 11.49,6.36 11.24,6.11 11.24,5.33 v11.03,5.12 | 11.85,6.36 12.1,6.11 12.1,5.3 12.09,5.3 U9.11 | 11.85,6.36 12.29,6.36 12.35,6.42 12.71,6.42 12.96,6.17 12.96,5.63 12.89,5.57 U9.9 | J2.5 3.32,2.48 v3.05,2.21 | U1.6 3.4,7.97 3.42,7.95 | v3.98,7.84 3.53,7.84 3.42,7.95 | U1.43 9.49,9.45 9.61,9.45 9.73,9.33 9.73,8.92 U1.19 9.9,6.48 9.77,6.35 | C4.1 15.52,13.86 v15.52,13.01 | 3.42,7.95 2.61,7.95 2.4,8.16 U1.4 | v7,13.8 7.75,13.05 U1.44 | v21.94,1.94 22.95,1.94 C7.2
  Top 0.305: U4.2 U4.7 | v20.98,12.92 21.94,14.08 J4.1 19.23,14.15 U3.7 | U1.45 U1.42 U1.43 U1.44 U1.45
  Route2 0.152: 14.76,12.15 14.69,12.08 | 14.67,12.06 14.69,12.08 | 14.69,12.08 v14.69,12.1 15,12.1 15.15,11.94 15.51,11.94 15.76,12.19 15.76,12.55 15.52,12.78 v15.52,13.01
  Route2 0.305: v15.52,13.01 16.93,13.44 17.18,13.2 19.66,13.2 19.92,13.46 20.34,13.46 20.63,13.17 20.63,12.77 v20.98,12.92
  Route3 0.152: v14.69,12.1 15,12.1 15.15,11.94 15.52,11.94 v16.05,11.42
  Bottom 0.152: 13.12,13.7 arc-45 13.01,13.65 | v11.67,15.13 13.04,15.13 13.32,14.85 U11.9 | 13.12,13.7 13.07,13.65 | U11.9 13.12,13.7 | C19.1 13.65,12.88 13.65,13.12 13.69,13.15 | 13.69,13.15 U11.4 14.37,12.42 v14.69,12.1 | U12.7 U12.2 13.38,9.01 13.38,8.91 13.5,8.79 13.53,8.79 v14.38,7.94 | 13.99,7.94 v14.38,7.94 | C18.1 13.71,7.27 v14.38,7.94 | 9.58,7.01 9.71,7.01 10.52,7.82 10.84,7.82 11.09,8.07 11.09,8.39 C20.1 | 9.58,7.01 C9.2 | 16.7,3.55 U8.9 | 16.7,3.55 16.03,3.55 U8.4 15.83,3.75 R12.1 14.89,3.73 C13.2 13.87,3.73 C15.2 C14.2 12.36,4.34 C16.2 11.03,4.84 v11.03,5.12 | C22.2 18.09,9.87 R3.1 | v17.28,5.12 17.28,4.12 16.7,3.55 | v9.72,6.3 9.58,6.44 9.58,7.01 | C8.2 6.43,6.96 v6.4,6.99 | J3.5 1.25,5.06 3.9,7.71 3.9,7.75 v3.98,7.84 4.13,7.99 4.13,8.01 4.84,8.71 C1.2 | U13.5 17.32,6.81 v17.45,6.81 | U11.9 13.32,13.98 13.99,14.65 U11.1 14.67,14.65 C17.1 | C6.2 9.29,4.81 v9.18,4.93 | 13.69,13.15 13.32,13.52 U11.9 | v20.98,12.92 20.98,13.85 C3.2 | J1.1 6.9,13.7 v7,13.8 | R17.1 21.61,2.27 v21.94,1.94 21.94,2.79 21.12,3.61 20.38,3.61 v19.86,4.13 | C21.1 16.03,11.39 v16.05,11.42
  Bottom 0.305: 13.07,13.65 U11.6 | v20.98,12.92 20.78,12.32 C2.2 19.48,12.31 R4.2 18.47,11.82 R3.1
  pour Route2 (no thermals): 0,0 0,9 4.5,9 4.5,16 26,16 26,3.5 22.5,3.5 22.5,0
  pour Bottom (no thermals): 0,0 0,9 4.5,9 4.5,16 26,16 26,3.5 22.5,3.5 22.5,0
GPIO0  (via drill 0.2)
  Top 0.152: U1.25 9.63,12.3 v9.34,12.6
  Bottom 0.152: J3.7 1.27,4.06 4.61,7.4 4.73,7.4 4.98,7.65 4.98,7.7 v5.13,7.85 5.2,7.92 5.2,8.27 5.31,8.38 5.31,9.31 5.49,9.5 | 5.49,9.45 5.49,9.5 | 5.49,9.5 5.49,10.94 5.9,10.94 7.57,12.6 v9.34,12.6
GPIO1  (via drill 0.2)
  Top 0.152: U1.23 9.29,11.3 v9.28,11.32
  Bottom 0.152: J3.8 1.75,3.56 v5.47,7.29 5.47,7.59 6,8.12 6,10.11 6.44,10.55 8.98,10.55 9.1,10.67 9.1,11.14 v9.28,11.32
GREEN
  Bottom 0.152: R14.1 15.66,6.75 U13.7
IN1  (via drill 0.2)
  Top 0.152: U1.14 7.4,7.92 v7.27,7.79
  Bottom 0.152: J3.9 1.43,3.06 1.65,3.28 2.09,3.28 6.22,7.42 6.58,7.42 6.58,7.41 6.89,7.41 v7.27,7.79
IN2  (via drill 0.2)
  Top 0.152: U1.15 7.9,7.83 v8,7.73
  Bottom 0.152: J3.10 1.86,2.56 5.8,6.5 7.31,6.5 7.43,6.62 7.43,7.29 7.48,7.29 7.6,7.41 7.68,7.41 v8,7.73
IN3  (via drill 0.2)
  Top 0.152: U1.16 8.4,8.13 v8.59,7.92
  Route3 0.152: v8.59,7.92 8.59,6.98 8.59,5.85 7.36,4.63 6.68,4.63 6.43,4.38 6.43,3.7 v5.43,2.7
  Bottom 0.152: J3.11 1.96,2.06 2.64,2.74 5.39,2.74 v5.43,2.7
INTACCEL  (via drill 0.2)
  Top 0.152: U1.34 7.9,14.31 v7.8,14.18 | v11.67,5.93 11.67,5.12 U9.12
  Route5 0.152: v7.8,14.18 8.45,13.76 8.45,10.15 8.88,9.71 8.88,8.95 10.79,7.04 11.13,7.04 11.67,6.49 v11.67,5.93
INTAIR  (via drill 0.2)
  Top 0.152: U5.3 v8.08,0.48 | U1.11 5.9,7.47 5.9,6.07 v5.94,6.03
  Route5 0.152: v5.5,3.43 8.08,0.85 v8.08,0.48
  Bottom 0.152: v8.08,0.48 R6.1 | v5.94,6.03 5.94,5.37 5.89,5.32 5.89,4.75 5.46,4.33 5.46,3.97 5.5,3.94 v5.5,3.43
INTBATT  (via drill 0.2)
  Top 0.152: U1.41 4.4,14.13 v4.67,13.86
  Route4 0.152: v11.95,12.29 11.85,12.39 11.85,12.78 11.85,12.89 9.91,14.83 9.33,14.83 9.23,14.93 4.73,14.93 4.48,14.68 4.48,14.05 v4.67,13.86
  Bottom 0.152: U11.5 12.27,12.51 12.08,12.32 11.99,12.32 v11.95,12.29
INTLIGHT  (via drill 0.2)
  Top 0.152: v13.32,6.62 13.32,7.32 U10.4 | v8.45,14.28 8.45,15.31 U1.33
  Route5 0.152: v13.32,6.62 12.27,7.67 10.63,7.67 10.23,8.07 10.23,8.75 8.72,10.26 8.72,13.68 8.74,13.71 8.72,13.79 8.72,14.01 v8.45,14.28
ISEN  (via drill 0.2)
  Top 0.152: v18.02,12.43 18.66,13.07 U3.4
  Bottom 0.152: v18.02,12.43 18.02,12.2 17.71,11.89 17.71,11.6 R3.2
LEDBRES  (via drill 0.2)
  Top 0.152: v13.94,6.11 13.94,6.21 D2.4
  Bottom 0.152: R15.2 14.09,6.11 v13.94,6.11
LEDGRES  (via drill 0.2)
  Top 0.152: v16.27,5.5 16.27,6.8 D2.3
  Bottom 0.152: R14.2 16.11,5.66 v16.27,5.5
LEDRRES  (via drill 0.2)
  Top 0.152: D2.2 17.37,8.1 17.51,8.1 17.75,7.86 v18.02,6.39
  Bottom 0.152: R13.2 17.29,6.23 v18.02,6.39
LXU4
  Top 0.305: U4.1 12.38,15.01 arc-45 12.43,15.12 12.51,15.2 arc45 12.61,15.16 U4.9
LXU12
  Bottom 0.305: U12.1 14.31,9.18 14.46,9.33 U12.9
MKOUT1
  Top 0.152: C11.1 16.54,1.87 MK1.4
MKOUT2
  Top 0.152: C11.2 R9.1
NTC_SENSE  (via drill 0.2)
  Top 0.152: U5.4 8.99,1.2 | 8.99,1.2 U5.5 | v8.99,0.57 8.99,1.2
  Bottom 0.152: R7.1 8.96,0.61 v8.99,0.57
RED
  Bottom 0.152: R13.1 U13.6
REGOUT  (via drill 0.2)
  Top 0.152: U9.10 12.49,5.82 v12.53,5.99
  Bottom 0.152: C14.1 12.38,5.84 v12.53,5.99
RESET  (via drill 0.2)
  Top 0.152: U5.2 7.48,0.62 v7.3,0.44 6.79,0.44 6.61,0.25 6.25,0.25 5.76,0.74 5.76,2.12 6.32,2.67 v6.32,5.14 | U1.8 4.4,8.02 4.41,8.02 4.41,7.98 v4.55,7.83
  Route4 0.152: v6.32,5.14 5.86,5.6 5.77,5.6 4.55,6.81 v4.55,7.83
  Bottom 0.152: v7.3,0.44 7.23,0.51 R5.1 | J3.6 1.23,4.56 4.08,7.41 4.16,7.41 4.41,7.66 4.41,7.68 v4.55,7.83
SCL  (via drill 0.2)
  Top 0.152: U6.2 25.25,0.64 v25.65,1.06 | U10.1 10.94,8.65 v10.68,8.97 | U5.10 6.88,4.18 v6.86,4.2 6.86,5.24 U7.9 | v12.48,0.41 12.64,0.6 12.67,1.1 13.29,1.56 U9.23 | U1.21 10.16,10.29 v9.33,10.29
  Route4 0.152: v0.93,7.85 0.93,9.06 0.99,9.13 8.31,9.13 | 11.17,8.26 11.17,7.2 11,7.04 10.77,7.04 10.65,6.91 9.57,6.91 v6.86,4.2 | 11.17,8.26 11.17,8.35 | 11.17,8.26 11.09,8.34 11.09,8.43 10.68,8.84 v10.68,8.97
  Route5 0.152: v25.65,1.06 25.26,0.65 14.04,0.65 13.39,1.31 13.03,1.31 12.67,1.11 12.64,0.61 v12.48,0.41 12.34,0.22 10.86,0.2 v6.86,4.2 6.48,4.58 5.71,4.58 5.61,4.47 1.11,4.47 0.93,4.66 v0.93,7.85 | 10.12,9.47 10.16,9.44 v10.68,8.97 | v17.85,8.62 16.99,9.48 16.26,9.48 16.18,9.57 11.6,9.57 11.59,9.55 10.2,9.55 10.12,9.47 | 10.12,9.47 9.33,10.26 v9.33,10.29
  Bottom 0.152: 11.32,14.09 11.38,14.15 U11.7 10.66,14.15 10.12,13.61 10.12,11.17 10.21,11.08 R1.2 | R1.2 9.95,10.31 | U13.2 17.69,8.4 v17.85,8.62 | J3.2 1.29,6.56 1.33,6.6 1.33,7.44 v0.93,7.85 | R1.2 9.54,10.57 9.33,10.36 v9.33,10.29
SDA  (via drill 0.2)
  Top 0.152: v9.15,14.4 9.36,14.61 arc45 9.4,14.71 U1.31 | U6.3 25.16,3.35 24.65,3.86 v24.65,4.16 | U10.2 10.91,8 v10.66,8.25 | v13.11,0.83 13.69,1.36 U9.24 | v7.49,4.2 U5.9 | U7.10 6.54,6.03 5.89,5.37 v5.89,4.15
  Route4 0.152: 14.66,8.72 20.03,3.36 23.85,3.36 v24.65,4.16 | 14.66,8.72 10.99,12.39 10.99,12.56 v9.15,14.4 8.85,14.1 8.85,10.06 v10.66,8.25 | v7.49,4.2 7.53,4.16 | 7.53,4.16 10.81,0.88 11.51,0.88 11.77,1.14 12.13,1.14 12.39,0.88 v13.11,0.83 | 14.66,8.72 14.69,8.72 15.23,8.19 18.02,8.19 v18.13,8.08 | 7.53,4.16 7.14,3.77 6.68,3.77 6.31,4.15 v5.89,4.15 0.86,4.15 0.35,4.66 v0.35,7.82
  Route5 0.152: v0.35,7.82 0.35,9.14 0.38,9.17 4.1,9.17 4.24,9.31 4.24,14.44 4.98,15.17 9.67,15.17 12.68,12.16 12.68,11.59 12.43,11.34 11.65,11.34 11.4,11.6 11.38,11.6 11.32,11.67 9.15,13.84 v9.15,14.4
  Bottom 0.152: R2.2 9.2,15.07 arc45 9.15,14.96 v9.15,14.4 10.25,14.4 arc45 10.36,14.45 10.59,14.68 12.21,14.68 arc-45 U11.8 | U13.3 18.1,8.01 v18.13,8.08 | J3.1 0.35,7.44 v0.35,7.82
TINOUT
  Top 0.152: U7.4 U7.5
VBUS  (via drill 0.2)
  Top 0.152: v15.33,12.37 15.79,12.68 U2.1 | Q1.G 17,14.08 17.45,14.08 v17.71,13.82 | U3.6 19.84,13.24 v20.13,12.96
  Route3 0.152: v15.33,12.37 16.05,12.37 v17.71,13.82
  Bottom 0.152: D1.A 17.59,13.7 v17.71,13.82 18.15,13.7 R4.1 19.38,13.22 C2.1 | C2.1 | v20.13,12.96 19.86,13.22 C2.1
VCCUSB  (via drill 0.2)
  Top 0.305: U2.4 U2.3 16.42,14.43 16.42,15.62 v16.39,15.65 | J2.1 5.39,5.08 v5.41,5.1
  Route3 0.305: v16.39,15.65 16.37,15.63 11.07,15.63 6.42,15.63 5.41,14.62 5.41,9.98 5.2,9.77 5.12,9.69 4.32,8.88 3.48,8.05 3.48,7.63 5.41,5.7 v5.41,5.1
VDD  (via drill 0.2)
  Top 0.152: U4.3 11.55,13.36 arc45 11.44,13.31 C5.2 v11.42,12.71 | U1.7 3.9,9.3 3.93,9.33 4.07,9.33 4.67,9.93 | 4.67,9.93 v4.67,9.95 | v6.43,9.93 | v6.43,9.93 4.67,9.93 | v14.93,11.4 14.6,11.4 14.39,11.18 13.87,11.18 13.25,11.8 13.25,12.6 13.26,12.6 U4.8 12.47,12.66 12.43,12.7 | U6.1 23.41,0.64 C7.1 22.21,1.06 v22.15,1.12 | U10.3 11.86,7.34 11.68,7.34 v10.95,6.61 | v13.42,5.81 13.29,5.77 U9.8 | U9.22 12.79,1.9 12.79,1.62 12.31,1.14 11.29,1.14 10.59,1.84 10.59,3.6 v10.04,4.15 | v10.04,4.15 10.44,4.55 U9.13 | U7.2 8.57,7.11 v9.12,7.66 | U5.6 C6.1 v10.04,4.15
  Top 0.305: U4.3 12.38,12.81 arc45 12.43,12.7 12.48,12.65
  Route3 0.152: v11.42,12.71 11.42,14.53 10.96,14.99 v10.96,15.11 | v1.54,7.84 1.69,7.99 1.69,8.02 2.99,9.32 4.04,9.32 v4.67,9.95 | v10.96,6.61 v10.95,6.61 12.71,6.61 13.14,7.05 14.18,7.05 14.37,7.23 | v6.23,1.98 8.02,3.77 9.65,3.77 v10.04,4.15 10.6,4.71 10.6,5.3 10.85,5.55 | v9.12,7.66 10.38,7.66 10.38,7.19 v10.96,6.61 | v22.15,1.12 17.34,5.93 14.36,5.93 | 14.36,5.93 14.12,5.68 13.76,5.68 13.67,5.78 v13.42,5.81 13.11,5.8 12.62,5.34 11.65,5.34 11.45,5.55 10.85,5.55 | 14.36,5.93 14.37,5.93 14.37,7.23 | 14.37,7.23 14.47,7.34 16.76,9.43 17.04,9.71 17.04,10.1 16.68,10.46 v16.68,11.42 16.25,10.99 15.87,10.99 15.47,11.4 v14.93,11.4 | 10.85,5.55 10.85,6.51 v10.96,6.61
  Bottom 0.152: U13.4 16.99,7.66 18.31,7.66 18.56,7.91 18.56,8.52 18.03,9.04 17.68,9.04 17.43,8.8 U13.1 17.19,9.06 C22.1 16.68,10.24 v16.68,11.42 | R2.1 10.64,15.31 v10.96,15.11 | J3.3 1.46,6.06 1.61,6.21 1.61,7.56 1.54,7.63 v1.54,7.84 | v11.42,12.71 11.34,12.71 10.4,11.77 10.4,11.29 R1.1 10.42,9.86 9.15,9.86 9.13,9.89 7.22,9.89 7.09,10.03 6.73,10.03 6.64,9.93 v6.43,9.93 | v4.67,9.95 4.67,9.42 C1.1 | R6.2 8.05,2.01 R5.2 6.26,2.01 v6.23,1.98 | C15.1 13.29,5.78 v13.42,5.81 | C16.1 10.42,4.15 10.13,4.15 | 10.13,4.15 v10.04,4.15 10.04,4.13 C6.1 | 10.13,4.15 10.13,3.42 10.38,3.17 10.38,2.4 R8.2 | v10.95,6.61 11.75,6.61 C18.2 | 9.12,7.51 v9.12,7.66 8.62,7.16 C9.1
  pour Route3 (no thermals): 0,0 0,9 4.5,9 4.5,16 26,16 26,3.5 22.5,3.5 22.5,0
VDDAUD  (via drill 0.2)
  Top 0.152: MK1.6 18.17,1.49 | 18.17,1.49 18.17,0.65 C10.1 | v19.75,1.49 18.17,1.49 | v6.91,9.6 U1.13
  Route3 0.152: v11.95,0.72 11.95,0.78 12.91,1.74 15.71,1.74 15.96,1.49 v19.75,1.49
  Route5 0.152: v11.95,0.72 10.47,2.2 10.47,6.97 8.6,8.84 8.6,9.6 v6.91,9.6
  Bottom 0.152: U8.8 18.88,2.05 19.66,2.05 R16.1 19.88,1.62 v19.75,1.49 | v11.95,0.72 12.18,0.95 12.18,3.69 12.24,3.75 R10.2
VDDLED  (via drill 0.2)
  Top 0.152: D2.1 15,8.73 v15,9.11
  Route3 0.152: v15,9.11 12.3,9.06 v11.41,9.98
  Bottom 0.152: C20.2 11.2,9.77 v11.41,9.98 11.78,9.94 11.94,10.1 | C21.2 15.11,9.21 v15,9.11
  Bottom 0.305: U12.3 12.1,9.18 11.94,9.34 11.94,10.1 U12.8
VIN  (via drill 0.2)
  Top 0.152: 15.06,15.03 C4.2 15.4,14.89 v15.92,14.82 | Q1.S 17.55,14.4 v17.81,14.4 | U4.4 14.66,13.36 14.66,13.12 v14.96,12.82
  Top 0.305: U4.6 14.78,14.98 arc-45 14.89,15.03 C4.2
  Route3 0.152: v14.96,12.82 14.78,12.88 | 14.78,12.88 14.26,12.36 14.26,11.66 v14.21,11.61 | 14.78,12.88 16.03,14.13 16.14,14.13 16.41,14.4 | 18.57,13.64 v17.81,14.4 16.41,14.4 | 18.57,13.64 21.67,10.54 25.24,10.54 25.24,4.05 24.59,3.4 23.2,3.4 22.58,2.78 22.58,0.94 22.33,0.69 21.97,0.69 20.32,2.34 12.97,2.34 10.97,0.34 9.91,0.34 9.24,1.01 7.26,1.01 6.87,0.62 6.87,0.52 6.61,0.25 5.73,0.25 5.55,0.44 3.63,0.44 2.11,1.96 v2.11,7.84 | v15.92,14.82 16.41,14.4 | v16.97,12.11 17.04,12.11 18.57,13.64
  Bottom 0.152: v16.97,12.11 v16.96,12.12 D1.K | C19.2 13.78,12.04 v14.21,11.61 14.21,11.51 U12.6 | v2.11,7.84 2.11,6.32 1.35,5.56 J3.4
WAKEAIR  (via drill 0.2)
  Top 0.152: U1.12 6.4,8.14 v6.7,7.84 | U5.7 v8.68,4.19
  Route5 0.152: v6.7,7.84 6.7,7.3 6.83,7.17 6.83,6.07 8.53,4.37 8.53,4.34 v8.68,4.19

### Text on the board
203bmp: v1-4